# Altium schematic sheet PWR_MGMT.SchDoc
size B; SheetNumber: 3; SheetTotal: 4
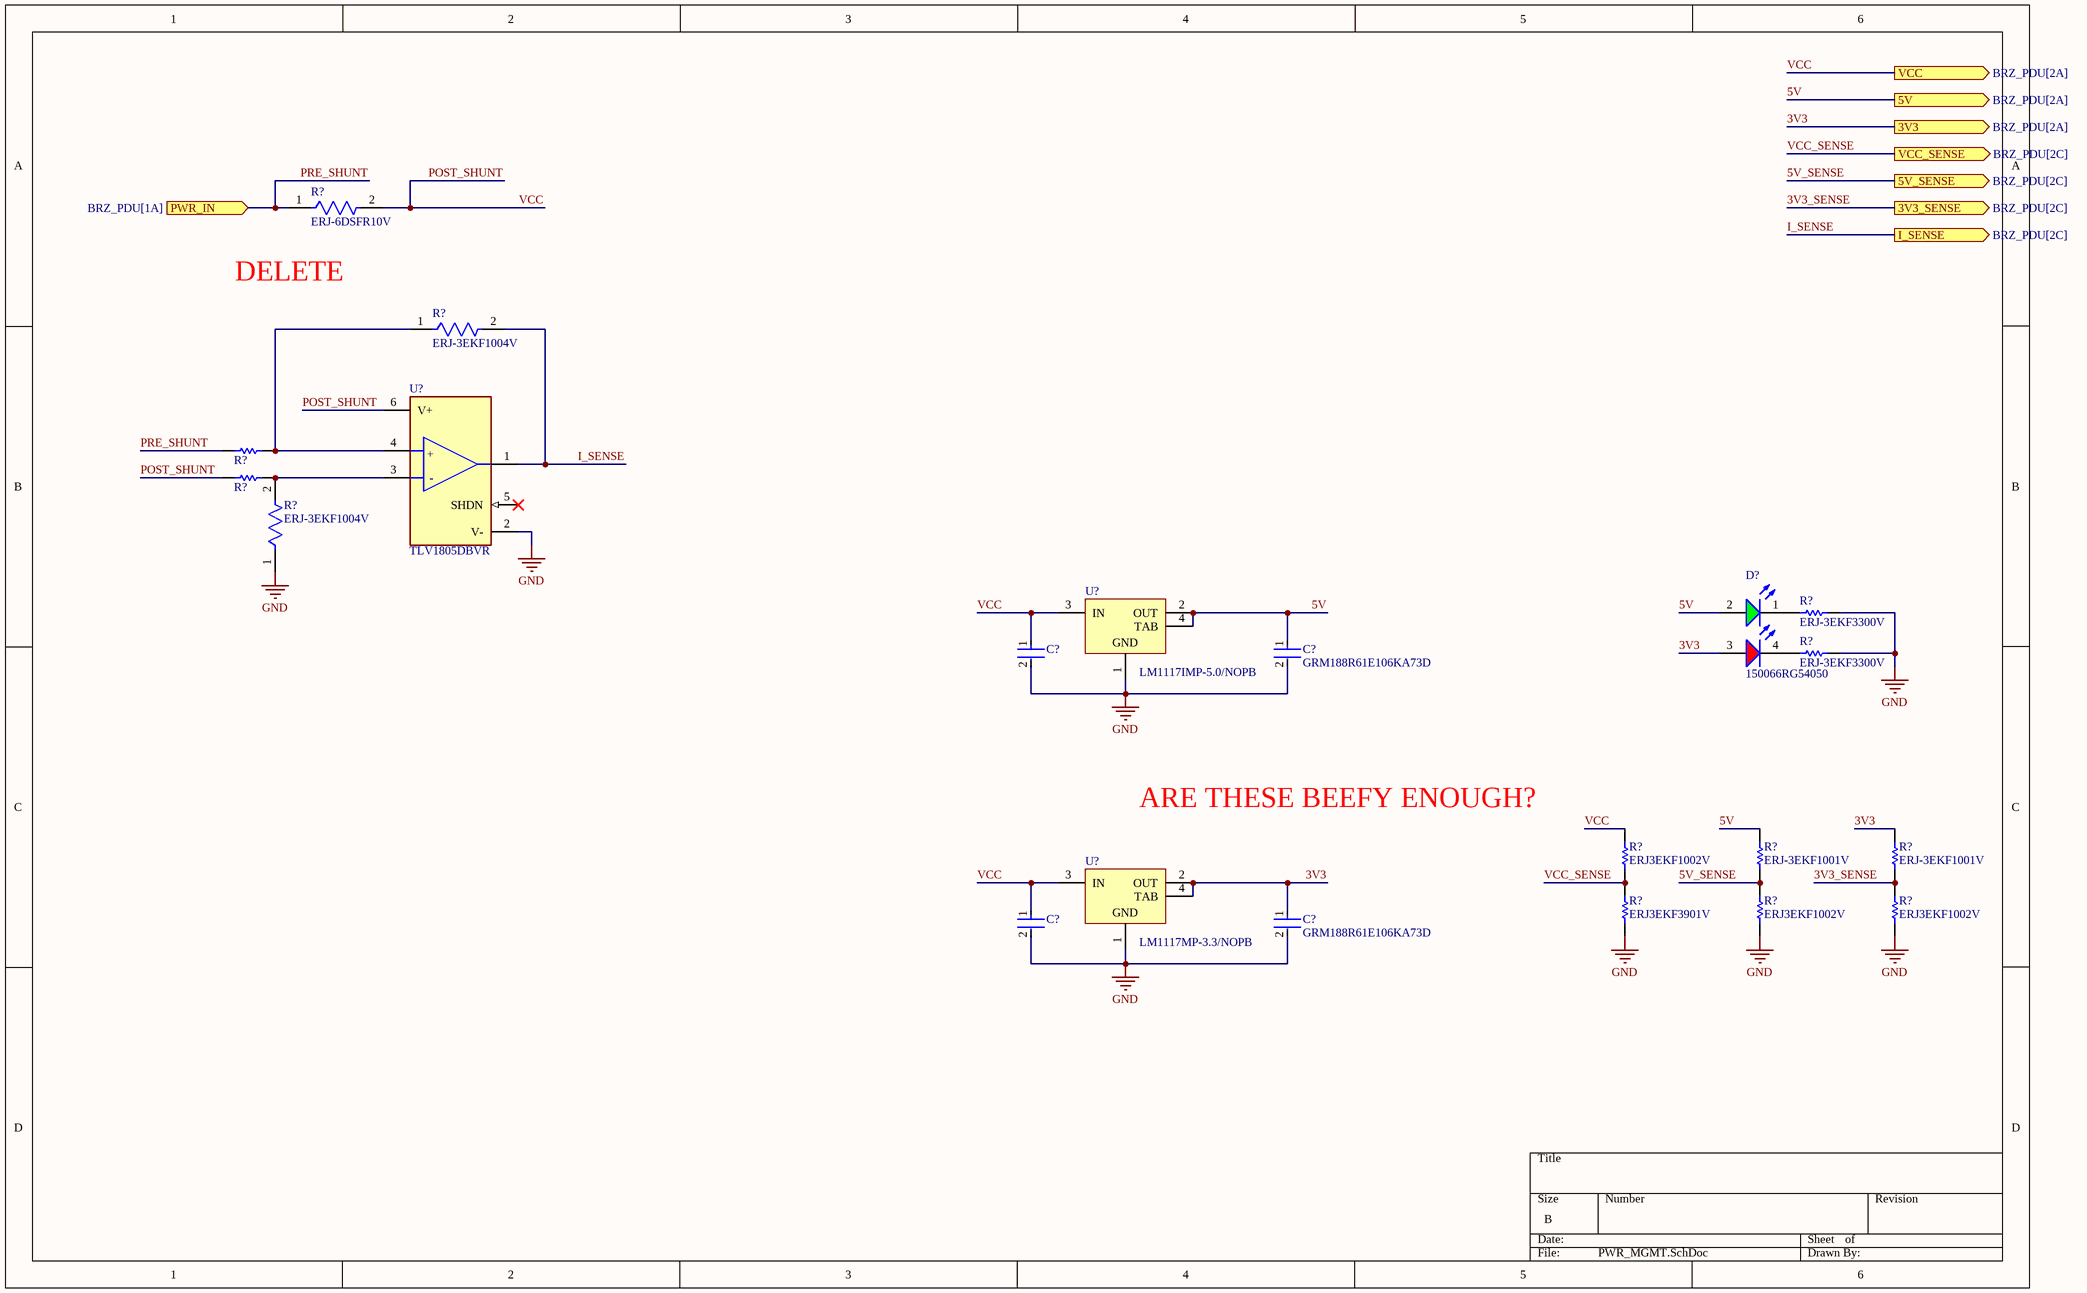
[diagram p0: PWR_MGMT.SchDoc]

## Parts
(Parts that share a designator on the sheet are numbered #1, #2 ... from top to bottom, then left to right.)
C?#1  GRM188R61E106KA73D  [FP-GRM188-0_2-IPC_A]  (value not drawn)
C?#2  GRM188R61E106KA73D  [FP-GRM188-0_2-IPC_A]
C?#3  GRM188R61E106KA73D  [FP-GRM188-0_2-IPC_A]  (value not drawn)
C?#4  GRM188R61E106KA73D  [FP-GRM188-0_2-IPC_A]
D?  150066RG54050  [WL-SBCD_0606]
R?#1  ERJ-6DSFR10V  [FP-ERJ6D-MFG]
R?#2  ERJ-3EKF1004V  [FP-ERJ3EK-IPC_C]
R?#3  ERJ3EKF1002V  [RESC1609X55X30LL15T15]  (value not drawn)
R?#4  ERJ3EKF1002V  [RESC1609X55X30LL15T15]  (value not drawn)
R?#5  ERJ-3EKF1004V  [FP-ERJ3EK-IPC_C]
R?#6  ERJ-3EKF3300V  [RESC1608X55X30LL15T15]
R?#7  ERJ-3EKF3300V  [RESC1608X55X30LL15T15]
R?#8  ERJ3EKF1002V  [RESC1609X55X30LL15T15]
R?#9  ERJ-3EKF1001V  [RESC1608X55X30LL15T15]
R?#10  ERJ-3EKF1001V  [RESC1608X55X30LL15T15]
R?#11  ERJ3EKF3901V  [RESC1608X55X30ML15T15]
R?#12  ERJ3EKF1002V  [RESC1609X55X30LL15T15]
R?#13  ERJ3EKF1002V  [RESC1609X55X30LL15T15]
U?#1  TLV1805DBVR  [FP-DBV0006A-IPC_C]
U?#2  LM1117IMP-5.0/NOPB  [DCY0004A_M]
U?#3  LM1117MP-3.3/NOPB  [DCY0004A_L]

## Ports
3V3 (out, see BRZ_PDU[2A]), 3V3_SENSE (out, see BRZ_PDU[2C]), 5V (out, see BRZ_PDU[2A]), 5V_SENSE (out, see BRZ_PDU[2C]), I_SENSE (out, see BRZ_PDU[2C]), PWR_IN (in, see BRZ_PDU[1A]), VCC (out, see BRZ_PDU[2A]), VCC_SENSE (out, see BRZ_PDU[2C])

## Nets
GND: C?#1.2 C?#2.2 C?#3.2 C?#4.2 R?#5.1 R?#6.2 R?#7.2 R?#11.1 R?#12.1 R?#13.1 U?#1.2(V-) U?#2.1(GND) U?#3.1(GND)
3V3: C?#4.1 D?.3(A) R?#10.2 U?#3.2(OUT) U?#3.4(TAB) ; port 3V3
3V3_SENSE: R?#10.1 R?#13.2 ; port 3V3_SENSE
5V: C?#2.1 D?.2(A) R?#9.2 U?#2.2(OUT) U?#2.4(TAB) ; port 5V
5V_SENSE: R?#9.1 R?#12.2 ; port 5V_SENSE
I_SENSE: R?#2.2 U?#1.1(OUT) ; port I_SENSE
POST_SHUNT: C?#1.1 C?#3.1 R?#1.2 R?#4.1 R?#8.2 U?#1.6(V+) U?#2.3(IN) U?#3.3(IN) ; port VCC  [also labelled VCC]
PRE_SHUNT: R?#1.1 R?#3.1 ; port PWR_IN
VCC_SENSE: R?#8.1 R?#11.2 ; port VCC_SENSE
NetD?_1: D?.1(K) R?#6.1
NetD?_4: D?.4(K) R?#7.1
NetR?#2_1: R?#2.1 R?#3.2 U?#1.4(+IN)
NetR?#4_2: R?#4.2 R?#5.2 U?#1.3(-IN)

Not connected (* = marked no-connect by the designer): U?#1 5(SHDN)*

## Notes on the sheet
- (near R?#1) DELETE
- ARE THESE BEEFY ENOUGH?
- (in symbol CMP-04896-000098-1) +; -

## Library data of the parts
C?#1-C?#4 = CMP-06035-045268-1: Chip Multilayer Ceramic Capacitors for General Purpose, 0603, 10uF, X5R, 15%, 10%, 25V; Case/Package: 0603
D? = CMP-03913-108242106-1: 150066RG54050 Led, Red/Grn, 180Mcd/230Mcd, 624Nm/525Nm Rohs Compliant: Yes; Power Dissipation: 48mW; Forward Current: 40mA; Max Reverse Voltage (DC): 5V; Forward Voltage: 2V; Viewing Angle: 130°; Luminous Intensity: 180mcd; Peak Wavelength: 520nm; Dominant Wavelength: 525nm; Width: 1.5mm; Min Operating Temperature: -40°C; Length: 1.6mm; RoHS: Compliant; Max Operating Temperature: 85°C; NexarPartId: 108242106; Height: 550µm
R?#1 = CMP-05422-000098-1: RES 0.1 OHM 1% 1/2W 0805; Temperature Coefficient: 150ppm/°C; Resistance: 100mR; Max Power Dissipation: 500mW; Tolerance: 1%; Length: 0.079inch; Features: Automotive AEC-Q200; Width: 0.049inch; Resistor Type: Thick Film; Case Code (Metric): 2012; Number of Terminations: 2; Max Operating Temperature: 155°C; Case/Package: 0805; Height: 0.028inch; Packaging: Cut Tape; Case Code (Imperial): 0805; Min Operating Temperature: -55°C
R?#2 R?#5 = CMP-1012-00849-3: RES SMD 1M OHM 1% 1/10W 0603; Resistance: 1MR; Voltage Rating: 75V; Temperature Coefficient: 100ppm/°C; Power Rating: 100mW; REACH SVHC: No SVHC; Radiation Hardening: No; Features: Automotive AEC-Q200; Case Code (Metric): 1608; Resistance Tolerance: 1%; Case/Package: 0603; Termination: SMD/SMT; Max Operating Temperature: 155°C; Tolerance: 1%; Size Code: 0603; Case Code (Imperial): 0603; Min Operating Temperature: -55°C; Number of Pins: 2; Mount: Surface Mount; Package Quantity: 1; Military Standard: Not; Voltage Rating (DC): 75V; Depth: 0.8mm; Packaging: Tape and Reel; Width: 0.8mm; Number of Terminations: 2; Length: 1.6mm; Height: 0.022inch; RoHS Compliant: Yes; Resistor Type: Thick Film; Contact Plating: Tin; Lead Free: Lead Free; Series: ERJ; Construction: Rectangular; Max Power Dissipation: 100mW
R?#3 R?#4 R?#8 R?#12 R?#13 = CMP-1012-00623-3: Chip Resistor, 10 KOhm, +/- 1%, 0.1 W, -55 to 155 degC, 0603 (1608 Metric), RoHS, Tape and Reel; Manufacturer: Panasonic; Voltage Rating: 75V; Case\/Package: 0603; Power Rating: 100mW; Resistance: 10KOhm; Temperature Coefficient: 100ppm\/degreesC; Number of Pins: 2; Package Reference: 603; Depth: 0.8mm; Mount: SurfaceMount; Package Description: 2-Pin Surface Mount Device, Body 1.6 x 0.85 mm; Datasheet Version: 02/2017; Length: 1.6mm; Lead Free: LeadFree; Height: 0.45mm; Number of Terminations: 2; Max Power Dissipation: 100mW; Min Operating Temperature: -55degC; Datasheet URL: https://industrial.panasonic.com/cdbs/www-data/pdf/RDA0000/AOA0000C304.pdf; Termination: SMD/SMT; Case Code (Metric): 1608; Case Code (Imperial): 0603; Tolerance: 1%; Max Operating Temperature: 155degC; RoHSCompliant: true; Voltage Rating (DC): 75V; Radiation Hardening: No; Packaging: TapeandReel; Composition: ThickFilm; Mounting Technology: SurfaceMount; Manufacturer URL: http://www.panasonic.com/; Width: 0.031inch; REACH SVHC: NoSVHC; Contact Plating: Tin; Military Standard: Not; Package Quantity: 1
R?#6 R?#7 = CMP-2000-00435-2: Chip Resistor, 330 Ohm, +/- 1%, 0.1 W, -55 to 155 degC, 0603 (1608 Metric), RoHS, Tape and Reel; Gender: Male; Mating Cycles: 10000; Current Rating: 500 mA; Voltage Rating: 10 V; REACH SVHC: No SVHC; PackageDescription: 2-Pin Surface Mount Device, Body 1.6 x 0.85 mm; Contact Finish: Gold; Pins: 8; ComponentLink1Description: Manufacturer URL; Packaging: Tape and Reel; Max Operating Temperature: 85 degC; Contact Material: Copper; Height: 1.45 mm; Width: 1.45 mm; DatasheetVersion: Apr-15; Package Quantity: 1500; Contact Plating: Gold; PackageReference: 0603; Mount: Surface Mount; Lead Pitch: 1.1 mm; Min Operating Temperature: -25 degC; ComponentLink1URL: http://www.panasonic.com/; ComponentLink2URL: http://industrial.panasonic.com/cdbs/www-data/pdf/RDA0000/AOA0000C86.pdf; Length: 13.7 mm; ComponentLink2Description: Datasheet; RoHSCompliant: true
R?#9 R?#10 = CMP-2000-00180-1: Manufacturer: Panasonic; Part Number: ERJ-3EKF1001V
R?#11 = CMP-2000-00475-1: Manufacturer: Panasonic; Part Number: ERJ3EKF3901V
U?#1 = CMP-04896-000098-1: 40V, RAIL-TO-RAIL INPUT, PUSH-PU
U?#2 = CMP-0062-01627-4: 800mA Low-Dropout Linear Regulator, 4-pin SOT-223, Pb-Free; Manufacturer: Texas Instruments; PackageTopMarking: XYTT*N06B; CompType: LDO IC; PowerWise: N; High-Reliability: Y; RoHS: Y; Code_JEDEC: TO-261-AA; ComponentLink1URL: http://www.ti.com/general/docs/lit/getliterature.tsp?genericPartNumber=LM1117-N&fileType=pdf; Code_IPC: SOT223-4; ComponentLink1Description: Datasheet URL; PartNumber: LM1117IMP-5.0/NOPB; PackageReference: DCY0004A; PinCount: 4; PackageDescription: Molded SOT-223, 6.50 x 3.56 x 1.6mm Body, 4 Lead, 2.3mm Pitch
U?#3 = CMP-0062-01638-4: 800mA Low-Dropout Linear Regulator, 4-pin SOT-223, Pb-Free; Manufacturer: Texas Instruments; CompType: LDO IC; PackageTopMarking: XYTT*N05A; High-Reliability: Y; PowerWise: N; ComponentLink1URL: http://www.ti.com/general/docs/lit/getliterature.tsp?genericPartNumber=LM1117-N&fileType=pdf; PinCount: 4; PackageDescription: Molded SOT-223, 6.50 x 3.56 x 1.6mm Body, 4 Lead, 2.3mm Pitch; Code_IPC: SOT223-4; PartNumber: LM1117MP-3.3/NOPB; Code_JEDEC: TO-261-AA; RoHS: Y; PackageReference: DCY0004A; ComponentLink1Description: Datasheet URL